# EAGLE design Tracksoar-Thermistor-Buzzer-Shield (EAGLE 7.7.0)
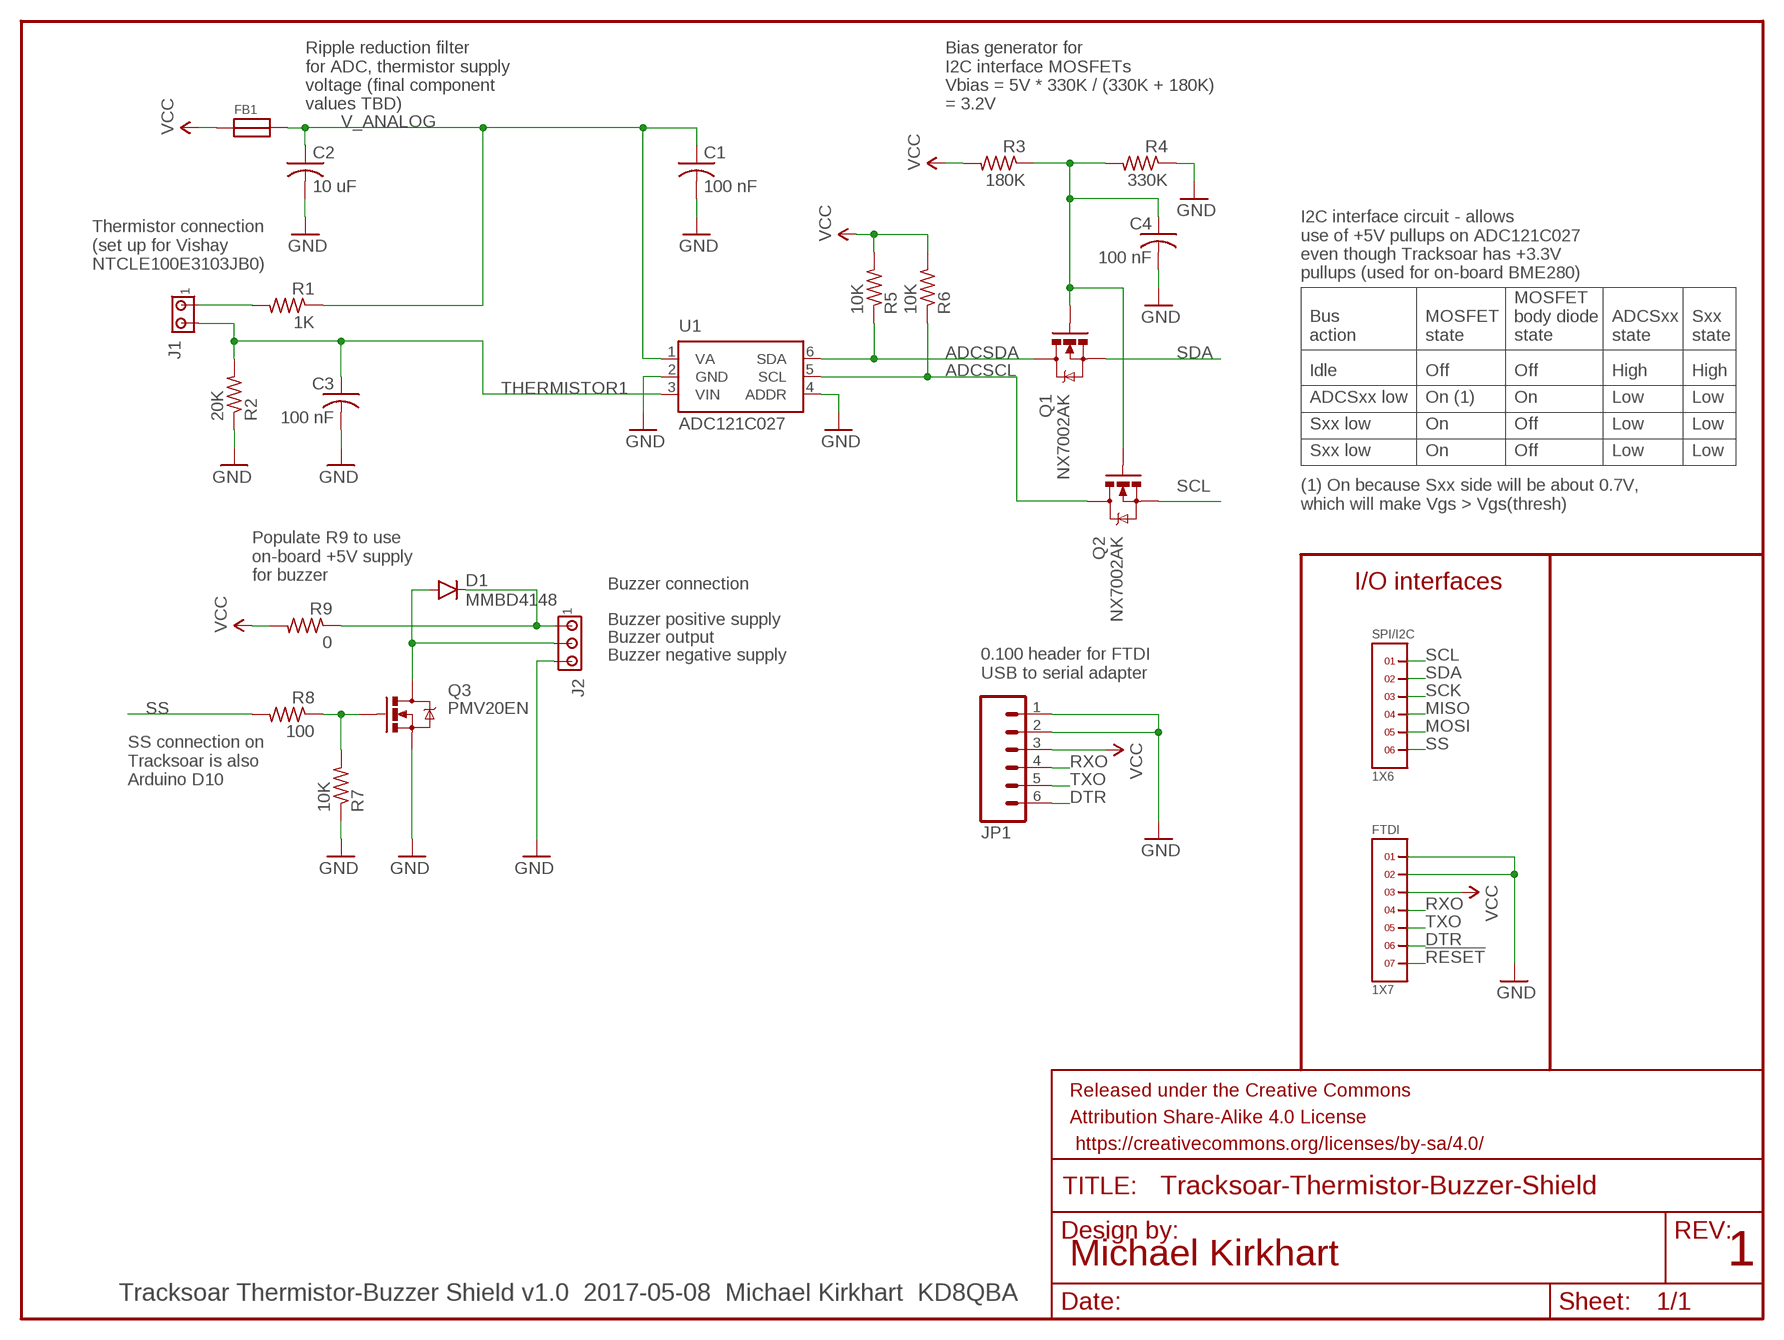
[diagram p0: schematic, sheet 1]

## Parts
C1  100 nF  C-USC0805  [C0805]
C2  10 uF  C-USC0805  [C0805]
C3  100 nF  C-USC0805  [C0805]
C4  100 nF  C-USC0805  [C0805]
D1  MMBD4148  DIODESOT23  [SOT23-3]
FB1  FERRITE0805  [0805]
FRAME1  FRAME-LETTER  [CREATIVE_COMMONS]
FTDI  1X7  [1X7]
J1  MTA02-100  [10X02MTA]
J2  MTA03-100  [10X03MTA]
JP1  M06SILK_FEMALE_PTH  [1X06]
Q1  NX7002AK  MOSFET-NCHANNELBSS123LT1G  [SOT23-3]
Q2  NX7002AK  MOSFET-NCHANNELBSS123LT1G  [SOT23-3]
Q3  PMV20EN  MOSFET-NCHANNELBSS123LT1G  [SOT23-3]
R1  1K  R-US_R0805  [R0805]
R2  20K  R-US_R0805  [R0805]
R3  180K  R-US_R0805  [R0805]
R4  330K  R-US_R0805  [R0805]
R5  10K  R-US_R0805  [R0805]
R6  10K  R-US_R0805  [R0805]
R7  10K  R-US_R0805  [R0805]
R8  100  R-US_R0805  [R0805]
R9  0  R-US_R0805  [R0805]
SPI/I2C  1X6  [1X6]
U1  ADC121C027  [SOT23-6]

## Nets
!RESET: FTDI.7
ADCSCL: Q2.3(D) R6.1 U1.5(SCL)
ADCSDA: Q1.3(D) R5.1 U1.6(SDA)
DTR: FTDI.6 JP1.6
GND: C1.2 C2.2 C3.2 C4.2 FTDI.1 FTDI.2 J2.3 JP1.1 JP1.2 Q3.2(S) R2.1 R4.1 R7.1 U1.2(GND) U1.4(ADDR)
MISO: SPI/I2C.4
MOSI: SPI/I2C.5
N$1: C4.1 Q1.1(G) Q2.1(G) R3.1 R4.2
N$2: Q3.1(G) R7.2 R8.1
N$3: J1.1 R1.2
N$6: D1.1(A) J2.2 Q3.3(D)
N$7: D1.3(C) J2.1 R9.1
RXO: FTDI.4 JP1.4
SCK: SPI/I2C.3
SCL: Q2.2(S) SPI/I2C.1
SDA: Q1.2(S) SPI/I2C.2
SS: R8.2 SPI/I2C.6
THERMISTOR1: C3.1 J1.2 R2.2 U1.3(VIN)
TXO: FTDI.5 JP1.5
V_ANALOG: C1.1 C2.1 FB1.2 R1.1 U1.1(VA)
VCC: FB1.1 FTDI.3 JP1.3 R3.2 R5.2 R6.2 R9.2

## Notes on the sheet
- Ripple reduction filter
  for ADC, thermistor supply
  voltage (final component
  values TBD)
- Bias generator for
  I2C interface MOSFETs
  Vbias = 5V * 330K / (330K + 180K)
  = 3.2V
- Thermistor connection
  (set up for Vishay 
  NTCLE100E3103JB0)
- I2C interface circuit - allows
  use of +5V pullups on ADC121C027 
  even though Tracksoar has +3.3V
  pullups (used for on-board BME280)
- Bus
  action
- MOSFET
  state
- MOSFET
  body diode
  state
- ADCSxx
  state
- Sxx
  state
- Idle | Off | Off | High | High
- ADCSxx low | On (1) | On | Low | Low
- Sxx low | On | Off | Low | Low
- Sxx low | On | Off | Low | Low
- (1) On because Sxx side will be about 0.7V, 
  which will make Vgs > Vgs(thresh)
- Populate R9 to use
  on-board +5V supply
  for buzzer
- Buzzer connection | I/O interfaces
- Buzzer positive supply
- Buzzer output
- Buzzer negative supply
- 0.100 header for FTDI
  USB to serial adapter
- SS connection on 
  Tracksoar is also
  Arduino D10
- Michael Kirkhart | 1
- Tracksoar Thermistor-Buzzer Shield v1.0  2017-05-08  Michael Kirkhart  KD8QBA

## Library data of the parts
C1-C4 = UMD-ECC-Picoballoon-1:C-US: CAPACITOR, American symbol
D1 = SparkFun-DiscreteSemi:DIODE: Diode These are standard reverse protection diodes and small signal diodes. SMA package can handle up to about 1A. SOD-323 can handle about 200mA. What the SOD-323 package when ordering, there are some mfgs out there that are 5-pin packages.
FB1 = UMD-ECC-Picoballoon-1:FERRITE: Ferrite Bead 0603 MMZ1608B121C - 120 Ohm, 600mA Ferrite Chip - Digikey: 445-2164-1-ND BK1608HW121-T - 120 Ohm, 600mA Ferrite Chip - Digikey: 587-1876-2-ND 0805 BLM21PG221SN1D - 220 ohm, 2000 mA Ferrite Chip - Mouser: 81-BLM21P221SG
FRAME1 = SparkFun-Aesthetics:FRAME-LETTER: Schematic Frame Standard 8.5x11 US Letter frame
FTDI = headers(2mm):1X7
J1 = UMD-ECC-Picoballoon-1:MTA02-100: AMP connector
J2 = con-amp:MTA03-100: AMP connector
JP1 = Tracksoar-Thermistor-Buzzer:M06: Header 6 Standard 6-pin 0.1" header. Use with straight break away headers (SKU : PRT-00116), right angle break away headers (PRT-00553), swiss pins (PRT-00743), machine pins (PRT-00117), and female headers (PRT-00115). Molex polarized connector foot print use with SKU : PRT-08094 with associated crimp pins and housings. NOTES ON THE VARIANTS LOCK and LOCK_LONGPADS... This footprint was designed to help hold the alignment of a through-hole component (i.e. 6-pin header) while soldering it into place. You may notice that each hole has been shifted either up or down by 0.005 of an inch from it's more standard position (which is a perfectly straight line). This slight alteration caused the pins (the squares in the middle) to touch the edges of the holes. Because they are alternating, it causes a "brace" to hold the component in place. 0.005 has proven to be the perfect amount of "off-center" position when using our standard breakaway headers. Although looks a little odd when you look at the bare footprint, once you have a header in there, the alteration is very hard to notice. Also,if you push a header all the way into place, it is covered up entirely on the bottom side. This idea of altering the position of holes to aid alignment will be further integrated into the Sparkfun Library for other footprints. It can help hold any component with 3 or more connection pins.; PROD_ID: CONN-08437
Q1-Q3 = SparkFun-DiscreteSemi:MOSFET-NCHANNEL: Common NMOSFET Parts MFG P/N Store ID Prod ID FDD8780 TRANS-09984 SI7820DN TRANS-11055 FDS6630A IC-08089 2N7002PW TRANS-11151 FQP30N06L COM-10213 TRANS-10060 BSS123LT1G TRANS-08345 BSS138 TRANS-00830 BS170 2N7000; PROD_ID: TRANS-08345
R1-R9 = UMD-ECC-Picoballoon-1:R-US_: RESISTOR, American symbol
SPI/I2C = headers(2mm):1X6
U1 = Tracksoar-Thermistor-Buzzer:ADC121C027

## Board
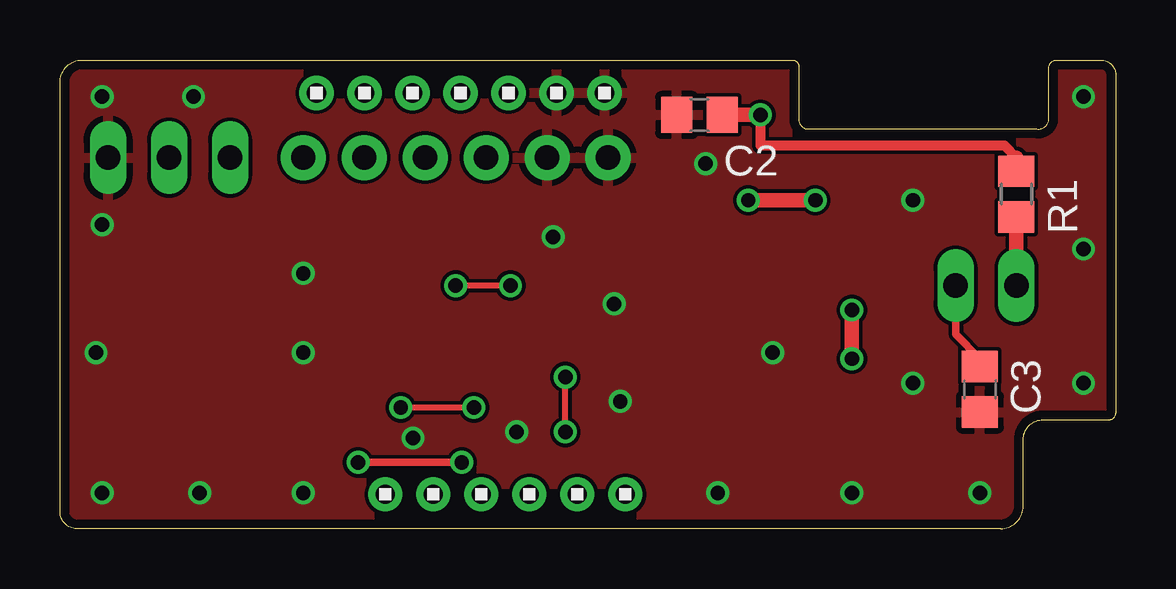
[diagram p1: board, top side]
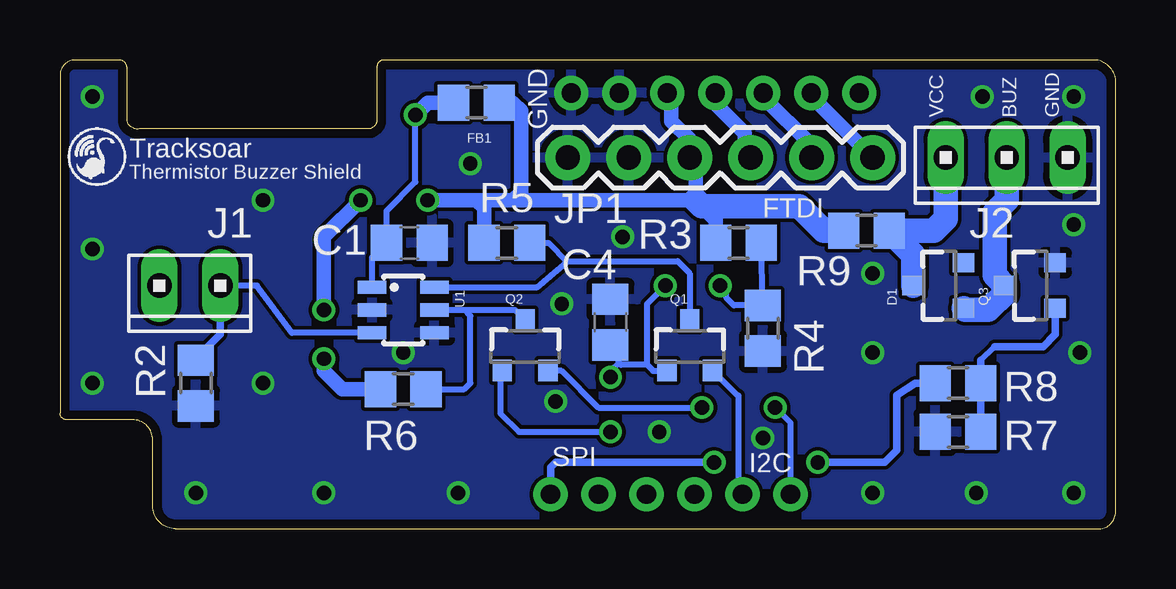
[diagram p2: board, bottom side, seen from below]

Size 43.99 x 19.53 mm. Coordinates in mm from the lower left corner, seen from the top.
Outline: 0.69,0 arc-90 0,0.76 0,18.67 arc-90 0.99,19.53 30.53,19.53 arc-90 30.79,19.23 30.79,17.02 arc90 31.19,16.66 40.69,16.66 arc90 41.2,17.02 41.2,19.23 arc-90 41.56,19.53 43.38,19.53 arc-90 43.99,18.87 43.99,4.83 arc-90 43.71,4.55 40.97,4.55 arc90 40.13,3.71 40.13,0.94 arc-90 39.19,0 0.69,0
Copper layers (1*16): Top 0.0356mm / dielectric 1.5011mm / Bottom 0.0356mm
Design rules "oshpark-2layer": minimum track width 6mil, minimum drill 13mil, track to track 6mil, track to pad 6mil, pad to pad 6mil, via to via 6mil, smd to smd 6mil, copper to edge 15mil, drill to drill 6mil, minimum pad ring 7mil, minimum via ring 7mil, stop-mask expansion 2.5mil, vias tented up to drill 0mil, thermal gap 10mil

### Footprints (pad centres in the part's own frame; a part is rotated, then mirrored left to right if it is on the bottom)
C0805 = smd 1.3 x 1.5: 1 -0.95,0; 2 0.95,0
SOT23-3 = smd 0.8 x 0.9: 1 -0.95,-1; 2 0.95,-1; 3 0,1.1
0805 = smd 1.3 x 1.5: 1 -0.95,0; 2 0.95,0
1X7 = drill 0.8 pad 1.422: 1 -6,0; 2 -4,0; 3 -2,0; 4 0,0; 5 2,0; 6 4,0; 7 6,0
10X02MTA = drill 1.016 long: 1 1.27,0; 2 -1.27,0
10X03MTA = drill 1.016 long: 1 2.54,0; 2 0,0; 3 -2.54,0
1X06 = drill 1.016 pad 1.88: 1 0,0; 2 2.54,0; 3 5.08,0; 4 7.62,0; 5 10.16,0; 6 12.7,0
R0805 = smd 1.3 x 1.5: 1 -0.95,0; 2 0.95,0
1X6 = drill 0.8 pad 1.422: 1 -5,0; 2 -3,0; 3 -1,0; 4 1,0; 5 3,0; 6 5,0
SOT23-6 = smd 0.55 x 1.2: 1 -0.95,-1.3; 2 0,-1.3; 3 0.95,-1.3; 4 0.95,1.3; 5 0,1.3; 6 -0.95,1.3

### Placement (x,y rotation side)
C1  29.44,11.91 0 bottom
C2  26.65,17.25 180 top
C3  38.33,5.82 270 top
C4  21.06,8.61 90 bottom
D1  7.34,10.13 90 bottom
FB1  26.65,17.75 180 bottom
FRAME1  14.35,-8.18 0 top  (outside the outline)
FTDI  16.69,18.16 180 top
J1  38.58,10.13 180 bottom
J2  4.55,15.47 180 bottom
JP1  22.84,15.47 0 bottom
Q1  17.76,7.59 0 bottom
Q2  24.61,7.59 0 bottom
Q3  3.53,10.13 90 bottom
R1  39.85,13.94 270 top
R2  38.33,6.07 90 bottom
R3  15.72,11.91 180 bottom
R4  14.71,8.36 90 bottom
R5  25.38,11.91 180 bottom
R6  29.69,5.82 180 bottom
R7  6.58,4.04 0 bottom
R8  6.58,6.07 180 bottom
R9  10.39,12.42 180 bottom
SPI/I2C  18.56,1.43 0 top
U1  29.69,9.12 270 bottom

### Tracks (layer width: path | path; a pad name or v marks a point on that pad's centre or on a via)
ADCSCL
  Bottom 0.254: U1.5 27.15,9.12 | 27.15,9.12 25.04,9.12 Q2.3 | R6.1 27.15,5.82 26.9,6.07 26.9,8.86 27.15,9.12
ADCSDA
  Bottom 0.254: U1.6 24.11,10.07 22.86,11.13 | 22.86,11.13 22.84,11.15 18.26,11.15 17.76,10.64 Q1.3 | R5.1 23.64,11.91 22.86,11.13
DTR
  Bottom 0.61: FTDI.6 12.69,18.02 JP1.6
GND  (via drill 0.6)
  other vias: 27.41,1.5 33,1.5 38.33,1.5 10.14,1.5 5.82,1.5 1.75,1.5 1.75,18.01 5.56,18.01 1.75,12.67 1.5,7.34 42.65,6.07 42.65,11.66 42.65,18.01 14.71,3.78 23.34,5.31 10.14,10.64 29.69,7.34 20.55,12.17 10.14,7.34 23.09,9.37 26.9,15.21 19.03,4.04 35.54,13.69 35.54,6.07
  pour Top: -0.02,19.48 -0.02,-0.03 40.11,-0.03 40.11,4.42 44.07,4.42 44.07,19.61 41.22,19.61 41.22,16.81 30.86,16.81 30.86,19.48
  pour Bottom: -0.02,19.48 -0.02,-0.03 40.11,-0.03 40.11,4.42 44.02,4.42 44.02,19.56 41.28,19.56 41.28,16.81 30.86,16.81 30.86,19.48
N$1  (via drill 0.6)
  Top 0.254: v21.06,4.04 v21.06,6.32 | v18.77,10.13 v16.49,10.13
  Bottom 0.254: v21.06,4.04 24.87,4.04 25.63,4.8 25.63,6.53 Q2.1 | 20.71,6.92 21.06,6.58 v21.06,6.32 | R3.1 R4.2 15.91,9.31 16.23,9.63 16.23,9.88 v16.49,10.13 | 19.53,6.83 19.53,9.37 v18.77,10.13 | 19.53,6.83 19.28,6.58 18.72,6.58 Q1.1 | 19.53,6.83 20.62,6.83 20.71,6.92 | 20.71,6.92 20.71,7.32 C4.1
N$2
  Bottom 0.254: 5.63,7.02 5.06,7.59 | 2.52,9.17 Q3.1
  Bottom 0.305: R7.2 R8.1 5.63,7.02 | 5.06,7.59 3.02,7.59 2.52,8.1 2.52,9.17
N$3
  Top 0.61: R1.2 J1.1
N$6
  Bottom 1.016: J2.2 4.55,13.69 5.06,13.18 5.06,10.56 Q3.3 4.63,9.8 5.31,9.12 6.28,9.12 D1.1
N$7
  Bottom 1.016: D1.3 8.44,11.42 R9.1 7.6,12.42 7.09,12.93 J2.1
RXO
  Bottom 0.61: FTDI.4 16.69,17.7 15.47,16.48 15.47,15.72 JP1.4
SCL  (via drill 0.6)
  Top 0.254: v17.25,5.05 v14.2,5.05
  Bottom 0.254: v17.25,5.05 21.57,5.05 23.09,6.58 23.65,6.58 Q2.2 | SPI/I2C.1 13.56,4.41 v14.2,5.05
SDA
  Bottom 0.254: SPI/I2C.2 15.72,1.6 15.72,5.56 15.77,5.56 Q1.2
SS  (via drill 0.6)
  Top 0.305: v12.42,2.77 v16.74,2.77
  Bottom 0.305: SPI/I2C.6 23.56,2.56 23.34,2.77 v16.74,2.77 | R8.2 8.36,6.07 9.12,5.56 9.12,3.28 9.63,2.77 v12.42,2.77
THERMISTOR1
  Top 0.305: C3.1 38.33,7.09 37.31,8.1 J1.2
  Bottom 0.254: U1.3 34.33,8.17 35.79,10.13 J1.2
  Bottom 0.305: R2.2 38.33,7.09 37.31,8.1 J1.2
TXO
  Bottom 0.61: FTDI.5 14.69,17.99 12.68,15.98 JP1.5
V_ANALOG  (via drill 0.6)
  Top 0.406: v29.19,17.25 29.19,15.98 39.35,15.98 39.85,15.47
  Top 0.61: C2.1 v29.19,17.25 | 39.85,15.47 R1.1
  Bottom 0.254: U1.1 30.99,11.31 C1.1 30.39,13.25 29.19,14.45 v29.19,17.25
  Bottom 0.61: v29.19,17.25 28.68,17.75 FB1.2
VCC  (via drill 0.6)
  Top 0.61: v33,7.09 v33,9.12 | v31.47,13.69 v28.68,13.69
  Bottom 0.61: FB1.1 25.12,17.75 24.78,17.41 24.78,14.03 25.12,13.69 | R6.2 32.23,5.82 33,6.58 v33,7.09 | v33,9.12 33,12.17 v31.47,13.69 | R3.2 16.67,12.86 17.25,13.44 | 25.12,13.69 17.5,13.69 17.5,15.21 JP1.3 17.76,16.23 18.52,16.99 18.52,17.99 FTDI.3 | 25.12,13.69 26.65,13.69 | 26.65,13.69 v28.68,13.69 | R5.2 26.33,13.37 26.65,13.69
  Bottom 1.016: 17.5,13.69 17.25,13.44 13.18,13.44 12.17,12.42 R9.2

### Text on the board
bNames: GND | BUZ | VCC | GND | Tracksoar | Thermistor Buzzer Shield | FTDI | SPI | I2C